# EAGLE design FCC Power Board Jan 2019 (EAGLE 9.2.2)
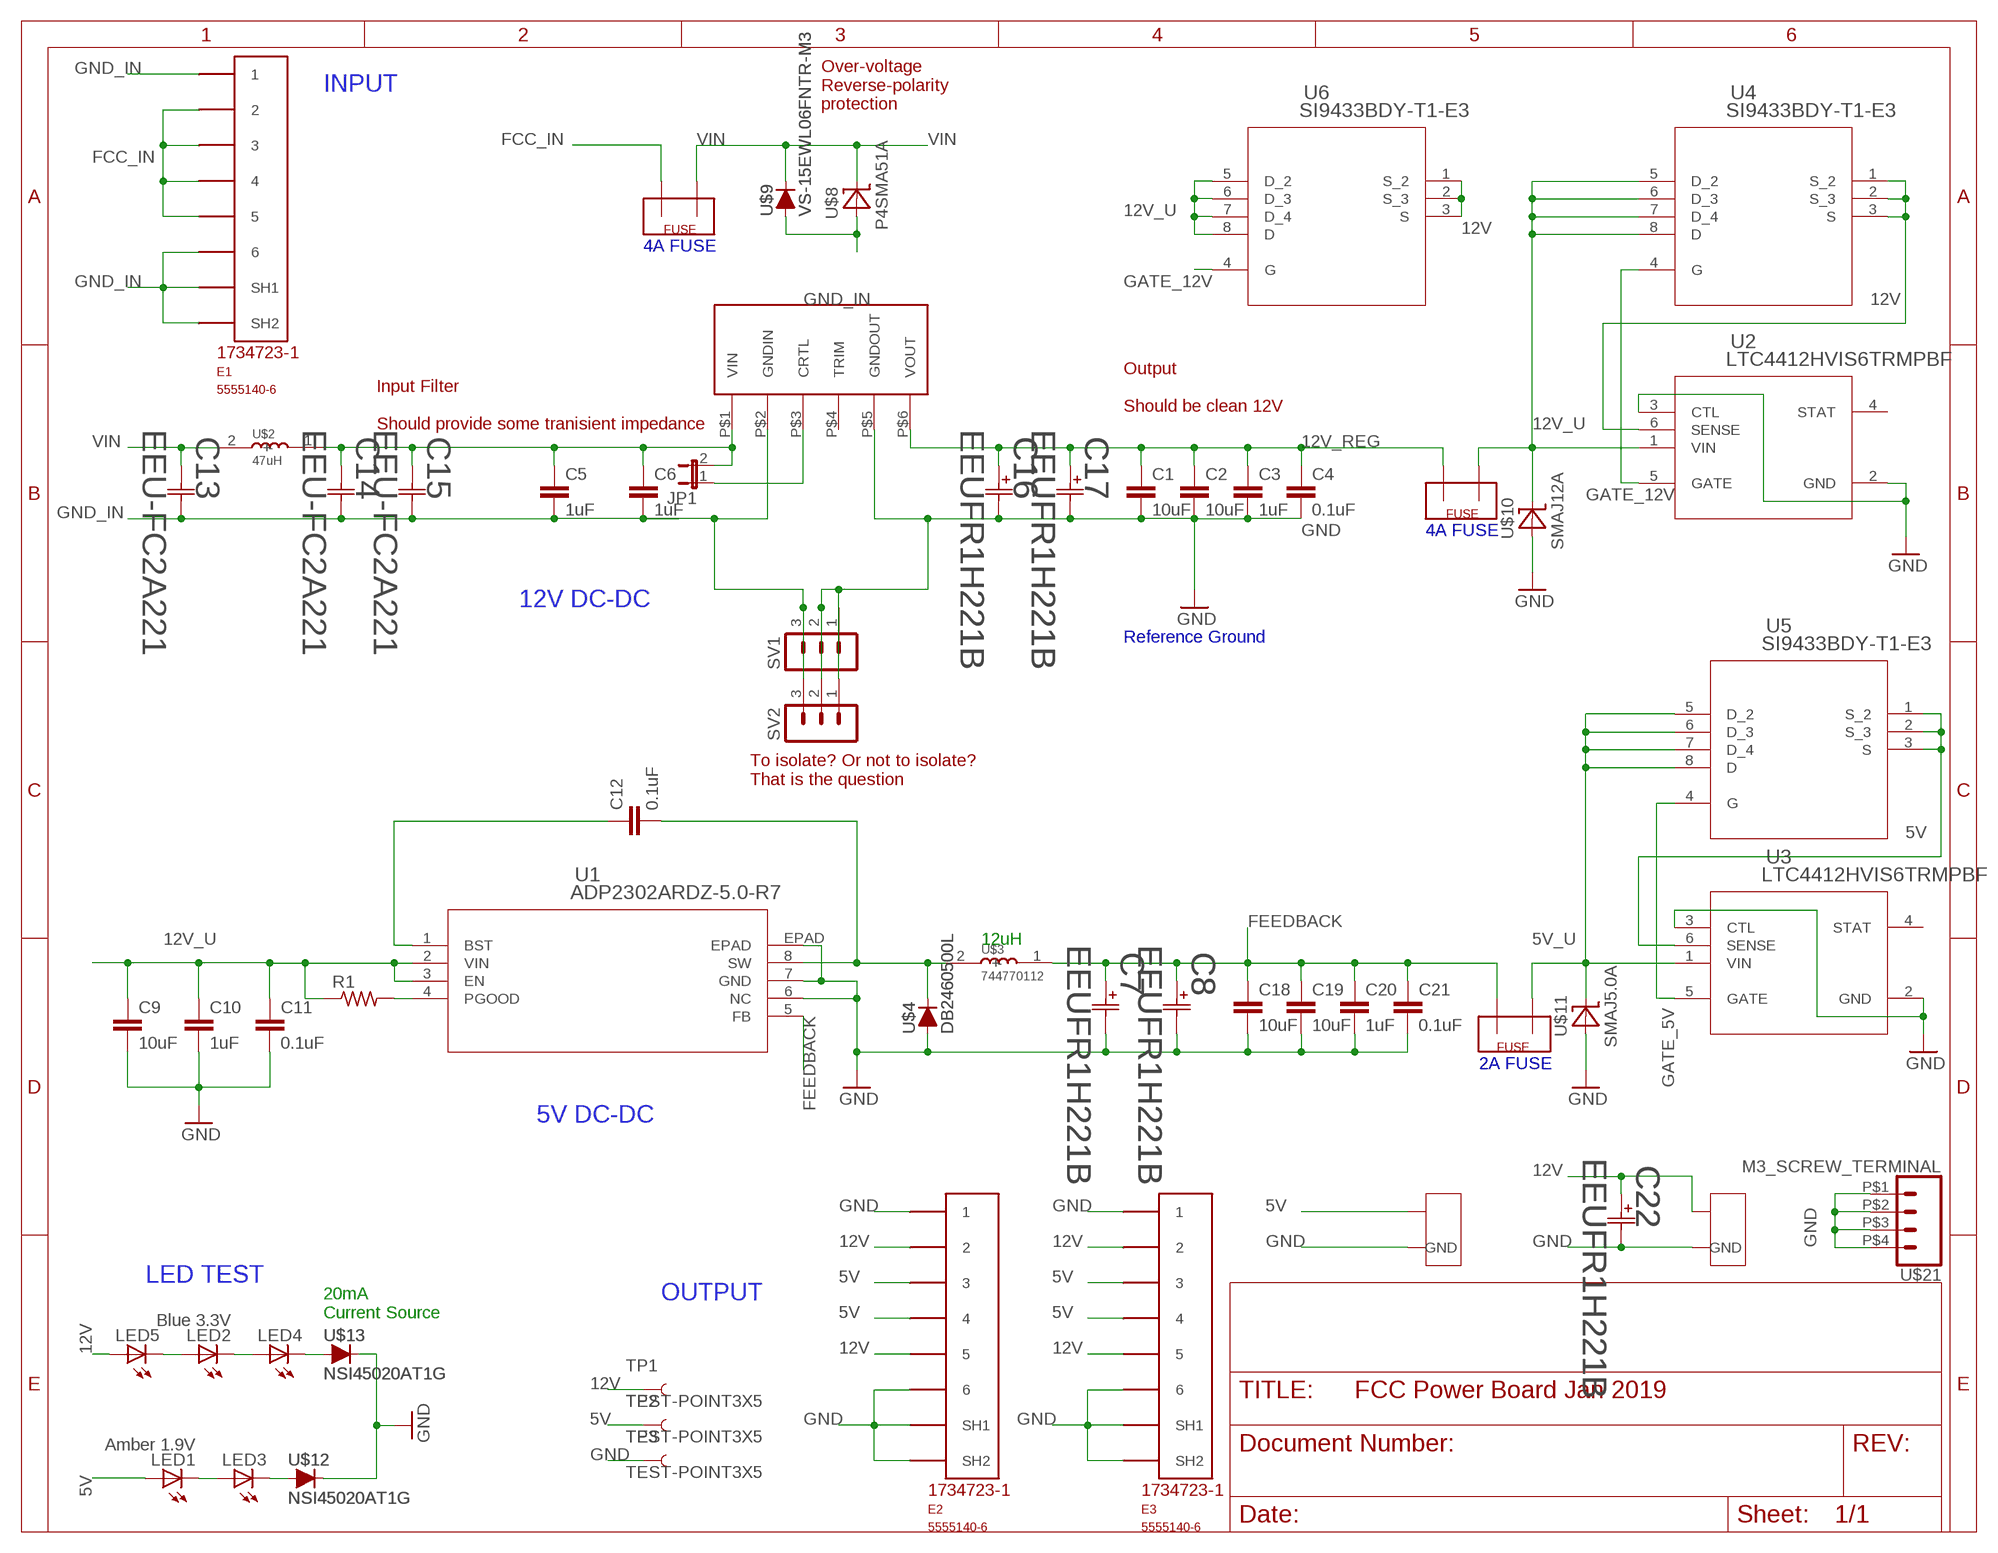
[diagram p0: schematic, sheet 1]

## Parts
C1  10uF  C-EUC1210  [C1210]
C2  10uF  C-EUC1210  [C1210]
C3  1uF  C-EUC0805  [C0805]
C4  0.1uF  C-EUC0603  [C0603]
C5  1uF  C-EUC1210  [C1210]
C6  1uF  C-EUC1210  [C1210]
C7  EEUFR1H221B  [CAP_PAN_10X16]
C8  EEUFR1H221B  [CAP_PAN_10X16]
C9  10uF  C-EUC1210  [C1210]
C10  1uF  C-EUC0805  [C0805]
C11  0.1uF  C-EUC0603  [C0603]
C12  0.1uF  C-EUC0603  [C0603]
C13  EEU-FC2A221  [CAP_16_X_25]
C14  EEU-FC2A221  [CAP_16_X_25]
C15  EEU-FC2A221  [CAP_16_X_25]
C16  EEUFR1H221B  [CAP_PAN_10X16]
C17  EEUFR1H221B  [CAP_PAN_10X16]
C18  10uF  C-EUC1210  [C1210]
C19  10uF  C-EUC1210  [C1210]
C20  1uF  C-EUC0805  [C0805]
C21  0.1uF  C-EUC0603  [C0603]
C22  EEUFR1H221B  [CAP_PAN_10X16]
E1  5555140-6  [1734723-1_RJ11]
E2  5555140-6  [1734723-1_RJ11]
E3  5555140-6  [1734723-1_RJ11]
JP1  JP1E  [JP1]
LED1  Amber 1.9V  LEDCHIPLED_0805  [CHIPLED_0805]
LED2  Blue 3.3V  LEDCHIPLED_0805  [CHIPLED_0805]
LED3  LEDCHIPLED_0805  [CHIPLED_0805]
LED4  LEDCHIPLED_0805  [CHIPLED_0805]
LED5  LEDCHIPLED_0805  [CHIPLED_0805]
R1  R-US_R0603  [R0603]
SV1  MA03-1  [MA03-1]
SV2  MA03-1  [MA03-1]
TP1  TEST-POINT3X5  [PAD.03X.05]
TP2  TEST-POINT3X5  [PAD.03X.05]
TP3  TEST-POINT3X5  [PAD.03X.05]
U1  ADP2302ARDZ-5.0-R7  [RD_8_1]
U2  LTC4412HVIS6TRMPBF  [TSOT-23_S6]
U3  LTC4412HVIS6TRMPBF  [TSOT-23_S6]
U4  SI9433BDY-T1-E3  [SOIC-N-8_SI]
U5  SI9433BDY-T1-E3  [SOIC-N-8_SI]
U6  SI9433BDY-T1-E3  [SOIC-N-8_SI]
U$1  RPA60-2412SFW_P  [RPA60-2412SFW/P]
U$2  47uH  PA4320  [INDUCTOR_SMD_FOOTPRINT]
U$3  744770112  [INDUCTOR_SMD_FOOTPRINT]
U$4  DB2460500L  [SOD123]
U$5  SHELL2013_FUSEMINI-BLADE  [SHELL2013_MINI-BLADE-FUSE]
U$6  SHELL2013_FUSEMINI-BLADE  [SHELL2013_MINI-BLADE-FUSE]
U$7  SHELL2013_FUSEMINI-BLADE  [SHELL2013_MINI-BLADE-FUSE]
U$8  P4SMA51A  [SMA-DO214AC]
U$9  VS-15EWL06FNTR-M3  [TO252]
U$10  SMAJ12A  [SMA-DO214AC]
U$11  SMAJ5.0A  [SMA-DO214AC]
U$12  NSI45020AT1G  [SOD123]
U$13  NSI45020AT1G  [SOD123]
U$18  2X1-CONN  [2X1-MATE-N-LOCK]
U$20  2X1-CONN  [2X1-MATE-N-LOCK]
U$21  M3_SCREW_TERMINAL  [M3_SCREW_TERMINAL]

## Nets
5V: E2.3 E2.4 E3.3 E3.4 LED1.A TP2.P$1 U3.6(SENSE) U5.1(S_2) U5.2(S_3) U5.3(S) U$18.CIRCUIT1
5V_U: U3.1(VIN) U5.5(D_2) U5.6(D_3) U5.7(D_4) U5.8(D) U$5.OUT U$11.K(C)
12V: C22.1 E2.2 E2.5 E3.2 E3.5 LED5.A TP1.P$1 U2.6(SENSE) U4.1(S_2) U4.2(S_3) U4.3(S) U6.1(S_2) U6.2(S_3) U6.3(S) U$20.CIRCUIT1
12V_REG: C1.1 C2.1 C3.1 C4.1 C16.1 C17.1 U$1.P$6(VOUT) U$7.OUT
12V_U: C9.1 C10.1 C11.1 R1.1 U1.2(VIN) U1.3(EN) U2.1(VIN) U4.5(D_2) U4.6(D_3) U4.7(D_4) U4.8(D) U6.5(D_2) U6.6(D_3) U6.7(D_4) U6.8(D) U$7.IN U$10.K(C)
FCC_IN: E1.2 E1.3 E1.4 E1.5 U$6.OUT
FEEDBACK: C7.1 C8.1 C18.1 C19.1 C20.1 C21.1 U1.5(FB) U$3.1(+) U$5.IN
GATE_5V: U3.5(GATE) U5.4(G)
GATE_12V: U2.5(GATE) U4.4(G) U6.4(G)
GND: C1.2 C2.2 C3.2 C4.2 C7.2 C8.2 C9.2 C10.2 C11.2 C16.2 C17.2 C18.2 C19.2 C20.2 C21.2 C22.2 E2.1 E2.6 E2.SH1 E2.SH2 E3.1 E3.6 E3.SH1 E3.SH2 SV1.1 SV1.2 SV2.1 SV2.2 TP3.P$1 U1.6(NC) U1.7(GND) U1.EPAD U2.2(GND) U2.3(CTL) U3.2(GND) U3.3(CTL) U$1.P$5(GNDOUT) U$4.A U$10.A U$11.A U$12.C U$13.C U$18.GND U$20.GND U$21.P$1 U$21.P$2 U$21.P$3 U$21.P$4
GND_IN: C5.2 C6.2 C13.2 C14.2 C15.2 E1.1 E1.6 E1.SH1 E1.SH2 SV1.3 SV2.3 U$1.P$2(GNDIN) U$8.A U$9.1(A) U$9.2(A)
N$1: JP1.1 U$1.P$3(CRTL)
N$3: C12.1 U1.1(BST)
N$4: C12.2 U1.8(SW) U$3.2(-) U$4.C
N$5: R1.2 U1.4(PGOOD)
N$7: LED1.C LED3.A
N$8: LED3.C U$12.A
N$9: LED4.C U$13.A
N$10: LED2.C LED4.A
N$11: LED2.A LED5.C
N$12: C5.1 C6.1 C14.1 C15.1 JP1.2 U$1.P$1(VIN) U$2.1(+)
VIN: C13.1 U$2.2(-) U$6.IN U$8.K(C) U$9.3(C)
Unconnected: U2.4(STAT) U3.4(STAT) U$1.P$4(TRIM)

## Notes on the sheet
- INPUT
- Over-voltage
  Reverse-polarity 
  protection
- 4A FUSE
- Output
  
  Should be clean 12V
- Input Filter
  
  Should provide some tranisient impedance
- 4A FUSE
- 12V DC-DC
- Reference Ground
- To isolate? Or not to isolate?
  That is the question
- 12uH
- 2A FUSE
- 5V DC-DC
- LED TEST
- OUTPUT
- 20mA 
  Current Source

## Library data of the parts
C1-C6 C9-C12 C18-C21 = rcl:C-EU: CAPACITOR, European symbol; SPICEPREFIX: C
C7 C8 C16 C17 C22 = MotorControllerEagleLibrary:EEUFR1H221B: Panasonic Capacitor, Digikey number P15375CT-ND; MANUFACTURER_PART_NUMBER: EEUFR1H221B; VENDOR: PANASONIC
C13-C15 = fc power board:EEU-FC2A221; MANUFACTURER_PART_NUMBER: EEUFC2A221; VENDOR: Panasonic
E1-E3 = 5555140-6 RJ11:5555140-6
JP1 = jumper:JP1E: JUMPER
LED1-LED5 = led:LED: LED OSRAM: - CHIPLED LG R971, LG N971, LY N971, LG Q971, LY Q971, LO R971, LY R971 LH N974, LH R974 LS Q976, LO Q976, LY Q976 LO Q996 - Hyper CHIPLED LW Q18S LB Q993, LB Q99A, LB R99A - SideLED LS A670, LO A670, LY A670, LG A670, LP A670 LB A673, LV A673, LT A673, LW A673 LH A674 LY A675 LS A676, LA A676, LO A676, LY A676, LW A676 LS A679, LY A679, LG A679 - Hyper Micro SIDELED® LS Y876, LA Y876, LO Y876, LY Y876 LT Y87S - SmartLED LW L88C, LW L88S LB L89C, LB L89S, LG L890 LS L89K, LO L89K, LY L89K LS L896, LA L896, LO L896, LY L896 - TOPLED LS T670, LO T670, LY T670, LG T670, LP T670 LSG T670, LSP T670, LSY T670, LOP T670, LYG T670 LG T671, LOG T671, LSG T671 LB T673, LV T673, LT T673, LW T673 LH T674 LS T676, LA T676, LO T676, LY T676, LB T676, LH T676, LSB T676, LW T676 LB T67C, LV T67C, LT T67C, LS T67K, LO T67K, LY T67K, LW E67C LS E67B, LA E67B, LO E67B, LY E67B, LB E67C, LV E67C, LT E67C LW T67C LS T679, LY T679, LG T679 LS T770, LO T770, LY T770, LG T770, LP T770 LB T773, LV T773, LT T773, LW T773 LH T774 LS E675, LA E675, LY E675, LS T675 LS T776, LA T776, LO T776, LY T776, LB T776 LHGB T686 LT T68C, LB T68C - Hyper Mini TOPLED® LB M676 - Mini TOPLED Santana® LG M470 LS M47K, LO M47K, LY M47K Source: http://www.osram.convergy.de LUXEON: - LUMILED® LXK2-PW12-R00, LXK2-PW12-S00, LXK2-PW14-U00, LXK2-PW14-V00 LXK2-PM12-R00, LXK2-PM12-S00, LXK2-PM14-U00 LXK2-PE12-Q00, LXK2-PE12-R00, LXK2-PE12-S00, LXK2-PE14-T00, LXK2-PE14-U00 LXK2-PB12-K00, LXK2-PB12-L00, LXK2-PB12-M00, LXK2-PB14-N00, LXK2-PB14-P00, LXK2-PB14-Q00 LXK2-PR12-L00, LXK2-PR12-M00, LXK2-PR14-Q00, LXK2-PR14-R00 LXK2-PD12-Q00, LXK2-PD12-R00, LXK2-PD12-S00 LXK2-PH12-R00, LXK2-PH12-S00 LXK2-PL12-P00, LXK2-PL12-Q00, LXK2-PL12-R00 Source: www.luxeon.com KINGBRIGHT: KA-3528ASYC Source: www.kingbright.com
R1 = resistor:R-US_: RESISTOR, American symbol
SV1 SV2 = con-lstb:MA03-1: PIN HEADER; OC_FARNELL: unknown; OC_NEWARK: unknown
TP1-TP3 = SparkFun-Connectors:TEST-POINT: SparkFun Test Points Bare copper test points for troubleshooting or In-Circuit-Testing. These are used by our Production team for verifying production board runs using pogo-pins on test beds. SparkFun Products: SparkFun LSM9DS1 Breakout <https://www.sparkfun.com/products/13284> SparkFun PSOC <https://www.sparkfun.com/products/13714> SparkFun Load Cell Amplifier <https://www.sparkfun.com/products/13879>
U1 = fc power board:ADP2302ARDZ-5.0-R7; MANUFACTURER_PART_NUMBER: ADP2302ARDZ5.0R7; VENDOR: Analog Devices Inc
U2 U3 = fc power board:LTC4412HVIS6TRMPBF; MANUFACTURER_PART_NUMBER: LTC4412HVIS6#TRMPBF; VENDOR: Linear Technology
U4-U6 = fc power board:SI9433BDY-T1-E3; MANUFACTURER_PART_NUMBER: SI9433BDYT1E3; VENDOR: Vishay
U$1 = RPA60-2412SFW_P:RPA60-2412SFW_P
U$2 = MotorControllerEagleLibrary:PA4320: Pulse Inductor, Digikey number 553-3685-1-ND.
U$3 = MotorControllerEagleLibrary:744770112
U$4 = fc power board:DB2460500L
U$5-U$7 = fc power board:SHELL2013_FUSE
U$8 = fc power board:P4SMA51A
U$9 = fc power board:VS-15EWL06FNTR-M3
U$10 = fc power board:SMAJ12A
U$11 = fc power board:SMAJ5.0A
U$12 U$13 = fc power board:NSI45020AT1G
U$18 U$20 = hydrogen_sensors_board_v3:2X1-CONN
U$21 = 36-7771-ND:M3_SCREW_TERMINAL

## Board
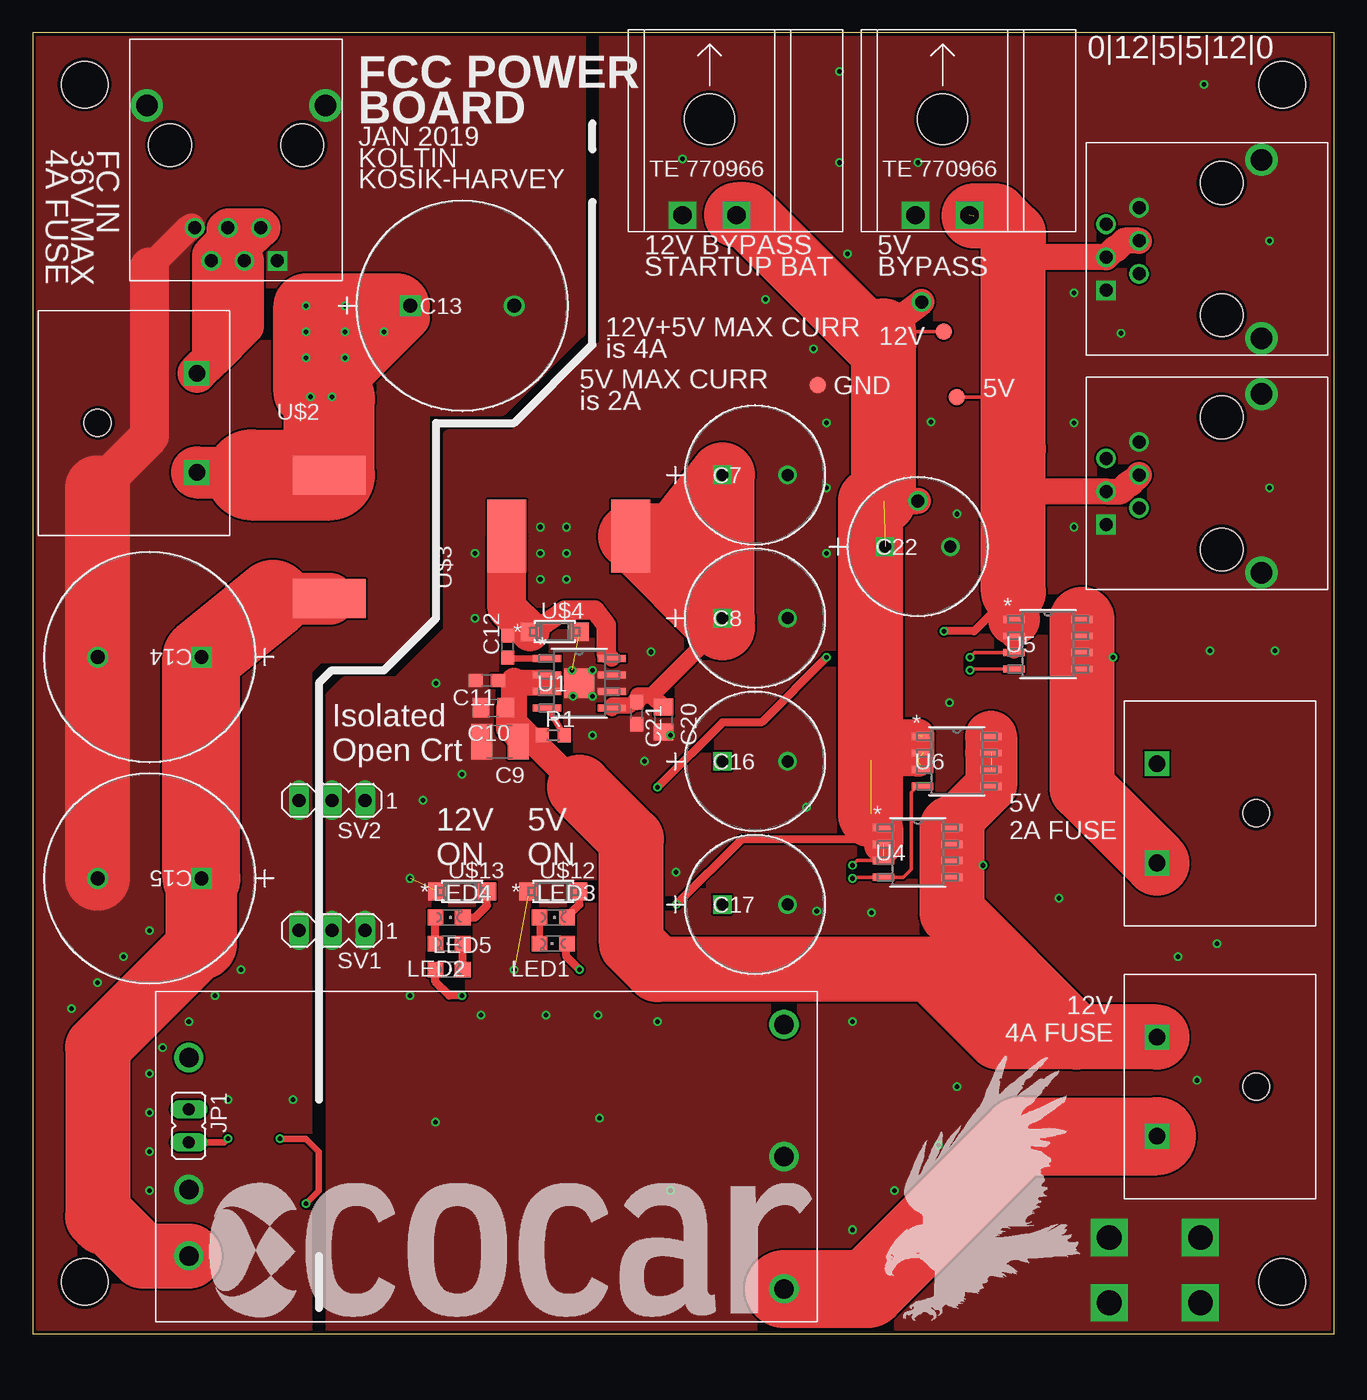
[diagram p1: board, top side]
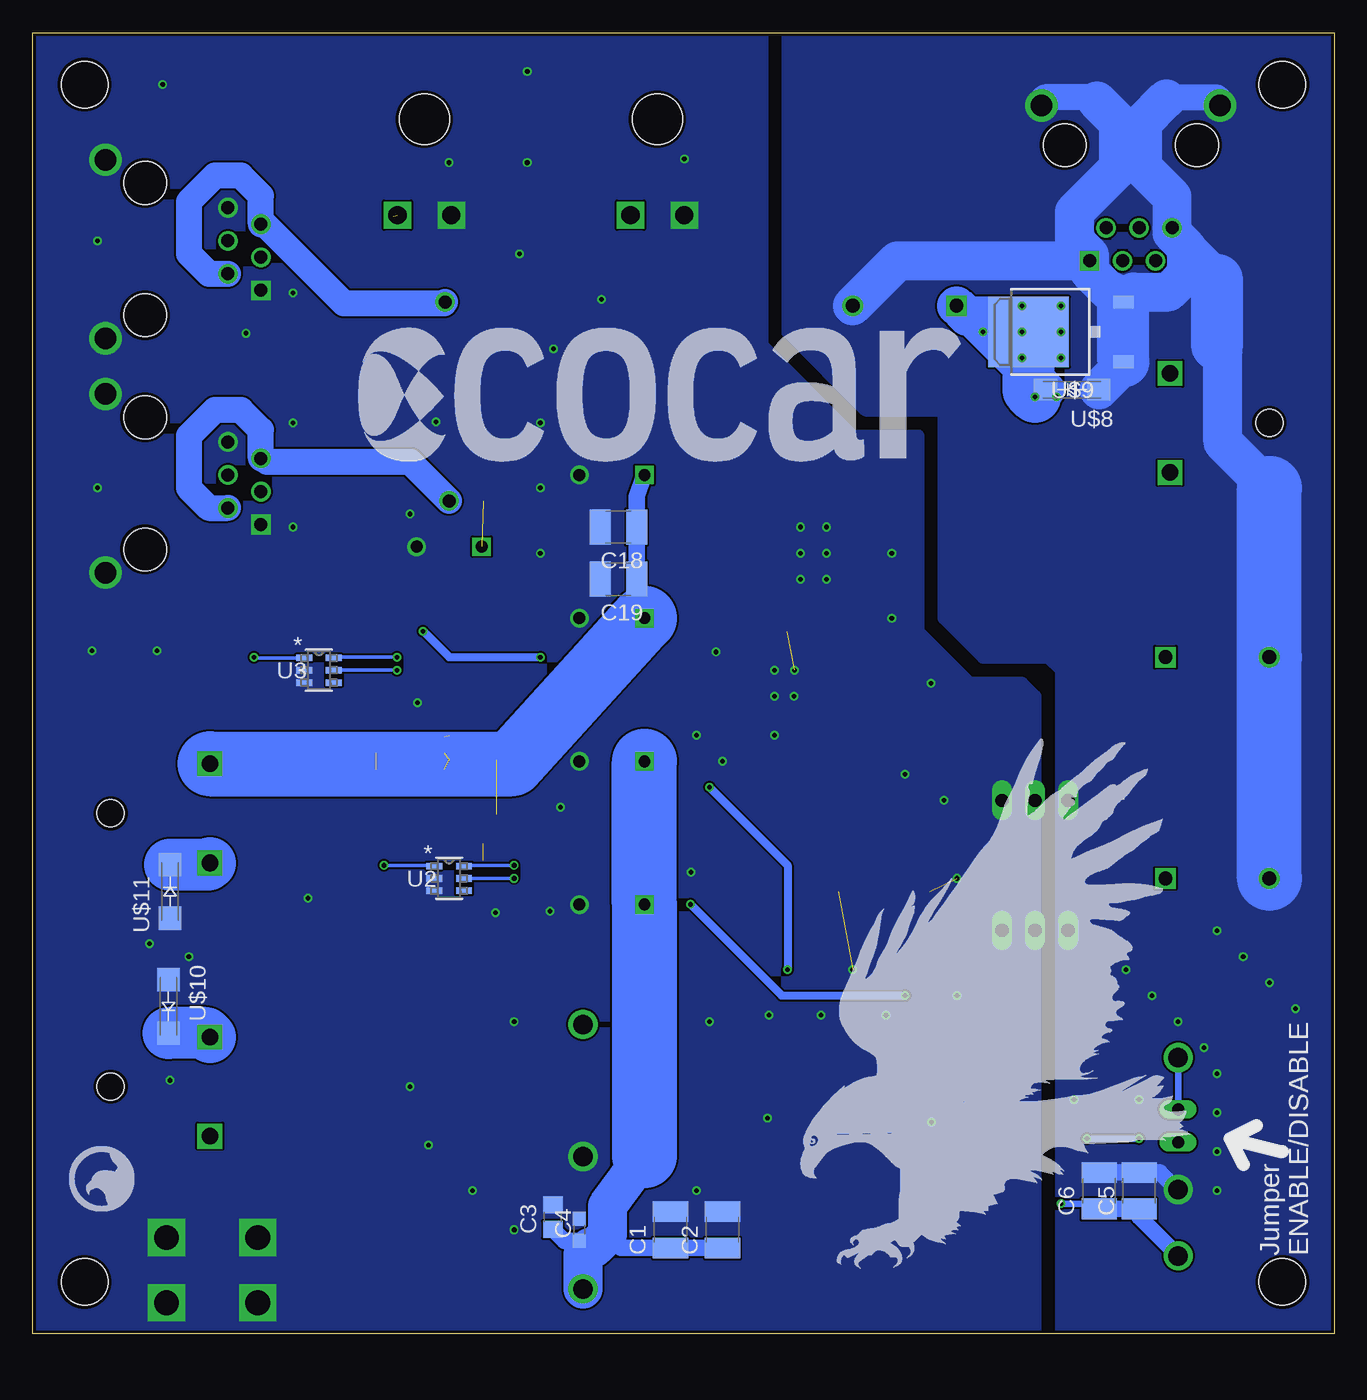
[diagram p2: board, bottom side, seen from below]

Size 100 x 100 mm. Coordinates in mm from the lower left corner, seen from the top.
Outline: 0,0 100,0 100,100 0,100 0,0
Copper layers (1*16): Top 0.035mm / dielectric 1.5mm / Bottom 0.035mm
Design rules "SeeedStudio_2layer_DRU_no_angle_20140221": minimum track width 6mil, minimum drill 12mil, track to track 6mil, track to pad 6mil, pad to pad 6mil, via to via 6mil, smd to smd 0mil, copper to edge 10mil, drill to drill 10mil, minimum pad ring 10mil, minimum via ring 6mil, stop-mask expansion 2mil, vias tented up to drill 100mil, thermal gap 10mil
Holes 3.6 mm at 96,96 96,4 4,96 4,4

### Footprints (pad centres in the part's own frame; a part is rotated, then mirrored left to right if it is on the bottom)
C1210 = smd 1.6 x 2.7: 1 -1.4,0; 2 1.4,0
C0805 = smd 1.3 x 1.5: 1 -0.95,0; 2 0.95,0
C0603 = smd 1.1 x 1: 1 -0.85,0; 2 0.85,0
CAP_PAN_10X16 = drill 0.914 pad 1.422 square: 1 -5.004,0 | drill 0.914 pad 1.422: 2 0,0
CAP_16_X_25 = drill 1.067 pad 1.575 square: 1 -7.976,0 | drill 1.067 pad 1.575: 2 0,0
1734723-1_RJ11 = drill 1 square: 1 -3.81,2.54 | drill 1: 2 -2.54,0; 3 -1.27,2.54; 4 0,0; 5 1.27,2.54; 6 2.54,0 | drill 1.65: SH1 -7.5,-9.4; SH2 6.22,-9.4 | hole 3.3: -5.72,-6.35; 4.44,-6.35
JP1 = drill 0.914 long: 1 0,-1.27; 2 0,1.27
CHIPLED_0805 = smd 1.2 x 1.2: A 0,-1.05; C 0,1.05
R0603 = smd 1 x 1.1: 1 -0.85,0; 2 0.85,0
MA03-1 = drill 1.016 long: 1 -2.54,0; 2 0,0; 3 2.54,0
PAD.03X.05 = smd 1.27 x 1.27: P$1 0,0
RD_8_1 = smd 2.184 x 0.559: 1 -2.489,1.905; 2 -2.489,0.635; 3 -2.489,-0.635; 4 -2.489,-1.905; 5 2.489,-1.905; 6 2.489,-0.635; 7 2.489,0.635; 8 2.489,1.905 | smd 2.286 x 2.286: EPAD 0,0
TSOT-23_S6 = smd 1.219 x 0.508: 1 -1.143,0.95; 2 -1.143,0; 3 -1.143,-0.95; 4 1.143,-0.95; 5 1.143,0; 6 1.143,0.95
SOIC-N-8_SI = smd 1.651 x 0.559: 1 -2.629,1.905; 2 -2.629,0.635; 3 -2.629,-0.635; 4 -2.629,-1.905; 5 2.629,-1.905; 6 2.629,-0.635; 7 2.629,0.635; 8 2.629,1.905
RPA60-2412SFW/P = drill 1.5: P$1 0,0; P$2 0,5.08; P$3 0,15.24; P$4 45.72,17.78; P$5 45.72,7.62; P$6 45.72,-2.54
INDUCTOR_SMD_FOOTPRINT = smd 5.6 x 3: 1 2.8,1.5; 2 2.8,11
SOD123 = smd 1.111 x 0.601: 1 -1.725,0; 2 1.725,0 | smd 1.4 x 1.4: A 1.9,0; C -1.9,0
SHELL2013_MINI-BLADE-FUSE = drill 1.27 square: IN 3.81,7.62; OUT -3.81,7.62 | hole 2.083: 0,0
SMA-DO214AC = smd 1.8 x 1.7: A -2.05,0; K 2.05,0
TO252 = smd 1 x 1.6: 1 -2.28,-4.8; 2 2.28,-4.8 | smd 5.4 x 6.2: 3 0,2.5
2X1-MATE-N-LOCK = drill 1.4 square: CIRCUIT1 -2.07,14.23; GND 2.07,14.23 | hole 3.86: 0,6.86
M3_SCREW_TERMINAL = drill 1.9 square: P$1 0,0; P$2 0,7.01; P$3 5,7.01; P$4 5,0

### Placement (x,y rotation side)
C1  51,8 90 bottom
C2  47,8 90 bottom
C3  60.04,8.98 90 bottom
C4  58,8 90 bottom
C5  15,11 90 bottom
C6  18.07,11 90 bottom
C7  58,66 0 top
C8  58,55 0 top
C9  35.9,45.5 180 top
C10  35.4,48.1 180 top
C11  34.9,50.2 180 top
C12  36.49,52.82 90 top
C13  37,79 0 top
C14  5,52 180 top
C15  5,35 180 top
C16  58,44 0 top
C17  58,33 0 top
C18  55,62 180 bottom
C19  55,58 180 bottom
C20  48.47,47.21 270 top
C21  46.4,47.7 270 top
C22  70.5,60.5 0 top
E1  15,85 180 top
E2  85,66 90 top
E3  85,84 90 top
JP1  12,16 180 top
LED1  40,30 90 top
LED2  32,30 90 top
LED3  40,32 270 top
LED4  32,32 270 top
LED5  32,28 270 top
R1  40,46 0 top
SV1  23,31 180 top
SV2  23,41 180 top
TP1  70,77 0 top
TP2  71,72 0 top
TP3  60.3,72.9 0 top
U1  42,50 0 top
U2  68,35 0 bottom
U3  78,51 0 bottom
U4  68,37 0 top
U5  78,53 0 top
U6  71,44 0 top
U$1  12,6 0 top
U$2  20,55 0 top
U$3  47.44,58.5 90 top
U$4  40.12,53.96 0 top
U$5  94,40 90 top
U$6  5,70 270 top
U$7  94,19 90 top
U$8  20.15,72.56 180 bottom
U$9  21,77 90 bottom
U$10  89.56,25.17 270 bottom
U$11  89.44,33.99 90 bottom
U$12  40,34 0 top
U$13  33,34 0 top
U$14  [ECOCAR_LOGO_2018]  13.57,1.28 0 top
U$15  [ECOCAR_LOGO_2018]  75,67 0 bottom
U$16  [CS-2016-LOGO-5MM]  98.1,8.5 0 bottom
U$17  [EAGLE-PLC-30MM]  41,5 0 bottom
U$18  69.9,100.2 180 top
U$19  [EAGLE-PLC-15MM]  65.5,1 0 top
U$20  52,100.2 180 top
U$21  82.7,7.4 270 top

### Tracks (layer width: path | path; a pad name or v marks a point on that pad's centre or on a via)
5V  (via drill 0.35)  (1 unrouted)
  Top 0.254: v72,52 72.36,52.37 U5.3 | TP2.P$1 75,72 75.34,69.66 75.34,68
  Top 0.61: 75.34,57.01 72.33,54 v70,54 | v61,52 56,47 53,47 v48,42 | v42,28 41,29 41,29.95 LED1.A | 74.48,84.52 75.34,84.52
  Top 1: U5.3 U5.2
  Top 2: U5.2 U5.1 | 75.34,84.12 76.09,84.87 | 75.34,68 76.07,67.27 | 75.34,65 75.61,64.73 E2.3 83.57,64.73 84.21,65.37 84.37,65.37 E2.4 | 75.34,84.52 77.13,82.73 E3.3 83.09,83.36 83.25,83.36 83.89,84 E3.4
  Top 4: U5.1 75.37,56.98 75.34,57.01
  Top 5: 75.34,57.01 75.34,65 75.34,68 75.34,84.12 75.34,84.52 | 75.34,84.52 75.36,84.54 | 75.34,84.52 73.96,85.9 72.3,85.9
  Bottom 0.254: U3.6 76.81,52 v72,52
  Bottom 0.61: v70,54 68,52 v61,52 | v48,42 42,36 v42,28
5V_U  (via drill 0.35)
  Top 0.254: 82.26,52 v83,52 81.53,52 U5.5
  Top 5: U$5.OUT 80.63,41.94 U5.5 U5.6 U5.7 U5.8
  Bottom 0.254: U3.1 82.95,51.95 v83,52
  Bottom 4: U$5.OUT 86.53,36.04 U$11.K
12V  (via drill 0.35, 1)  (6 unrouted)
  Top 0.254: v63,36 63.37,36.37 U4.3 | TP1.P$1 65.38,77
  Top 0.61: U4.1 64.47,38 62,38 54.46,37.99 v49.46,33 | v33,26 32,26 30.95,27.05 LED5.A
  Top 2: 64.37,64 65.38,64 v68,64 | v68.3,79.3 68.3,79.29 65.38,77.06
  Top 2.54: 64.6,46 68,46 68,44.1 64.4,44.1
  Top 3: 64.37,39.91 U4.1 U4.2
  Top 5: 64.37,39.91 64.37,64 | 65.38,64 65.38,76.04 | 65.38,77.06 65.38,77 65.38,76.04 | 65.38,76.04 65.08,75.74 54.82,86 54.1,86 U$20.CIRCUIT1 | 65.38,76.04 65.4,76.06
  Bottom 0.254: U2.6 66.81,36 v63,36
  Bottom 0.61: v49.46,33 42.45,26 v33,26
  Bottom 2: v68,64 71,67 82,67 82.27,67.27 E2.5 82.46,69.46 84,71 86,71 88,69 88,65 86.46,63.46 E2.2 | v68.3,79.3 68.4,79.2 76.09,79.2 82.16,85.27 E3.5 82.46,87.46 84,89 86,89 88,87 88,83 86.46,81.46 E3.2
12V_REG
  Top 6: U$1.P$6 64.15,3.46 75.88,15.19 U$7.OUT
  Bottom 1.27: C2.1 C1.1 54.83,6.6 55.85,7.62 | U$1.P$6 57,5.18 C4.1 59.16,7.15 C3.1
  Bottom 3: 53,13.69 55.85,9.84 55.85,7.62 56.82,6.65 57.2,6.65 57.72,6.13 U$1.P$6
  Bottom 5: C16.1 C17.1 53,13.69
12V_U  (via drill 0.35)  (1 unrouted)
  Top 0.254: v73,36 72.64,36.37 U4.6
  Top 0.508: C11.1 37,50.2 39.2,50.2 U1.2 | U1.3 39.63,50.05 | C9.1 37.8,46 R1.1
  Top 0.61: C9.1 38.09,46.29
  Top 1.5: 38.82,50.05 39.63,50.05 | C10.1 36.35,46.45 C9.1 37,45.8 37,47
  Top 2: 42.01,41.99 37,47 37,50.2 37.15,50.05 39.63,50.05
  Top 2.54: 70.63,39.09 U4.7
  Top 4: 70.63,39.09 U6.5 U6.7 U6.8
  Top 5: 80.19,22.81 70.63,32.37 U4.5 U4.6 U4.7 U4.8 | U$7.IN 80.19,22.81 | 80.19,22.81 74.19,22.81 69,28 48,28 46,30 46,38 42.01,41.99
  Bottom 0.254: U2.1 69.19,36 v73,36
  Bottom 4: U$7.IN 86.69,23.12 U$10.K
FCC_IN
  Top 1.5: E1.3 16.27,83.77
  Top 3: 16.27,83.77 17.37,84.87 17.41,84.87 E1.2 E1.4 14.87,84.87 14.87,84 13.73,82.87 E1.5 | E1.5 13.73,74.92 | 13.73,74.92 U$6.OUT | E1.5 14,82.19 14,82 15.81,82 E1.3 16.27,77.46 13.73,74.92
FEEDBACK
  Top 0.61: 52.52,54 C8.1
  Top 1: 46.53,49.05 45.78,48.3
  Top 1.27: 45.78,48.3 44.56,48.3 U1.5 | 47.58,49.05 46.53,49.05 46.53,48.69 C21.1 | 47.58,49.05 C20.1 | 47.58,49.05 52.52,54
  Top 5: 53,54.24 C8.1 C7.1 49.3,61.3 U$3.1 53,54.24
  Bottom 1.27: C7.1 53.6,64.4 C18.1 C19.1 53.6,54.6 C8.1
  Bottom 5: U$5.IN 63.19,43.81 C8.1
GATE_5V  (via drill 0.35)
  Top 0.254: v72,51 72.09,51.09 U5.4
  Bottom 0.254: U3.5 v72,51
GATE_12V  (via drill 0.35)
  Top 0.254: v63,35 63.09,35.09 U4.4 66.89,35.09 67.5,35.7 67.5,41.6 68,42.09 U6.4
  Bottom 0.254: U2.5 v63,35
GND  (via drill 0.35)  (3 unrouted)
  other vias: 49,46 41.52,49.01 61,60 95,65 95,84 61,70 88,29 62,97 49.44,35.48 69.6,14.5 63,24 49,11 63,8 71,19 91,30 31,50 34,55 34,60 43,46 48,24 66.2,11 41.45,51.01 41,60 39,60 41,62 39,62 39,58 41,58 43,49 43,51 34.44,24.48 39.44,24.48 43.44,24.48 59.44,40.48 60.24,32.48 70.44,48.48 90.44,52.48 95.44,52.48 89.44,19.48 33,43 30,41 29,35 29,26 37,28 47,44 62.6,83 56.3,79.5 61,65 71,63 83.6,76.9 69,70.1 60,75.7 80,70 80,62 80,80 90,96 68,90 62,90 43.54,16.58 30.94,16.28 64.44,32.38 78.84,33.48 49.94,90.28 47.5,52.4
  pour Top (no thermals): 44,104 44,76 37,69 32,69 32,54 28,50 24,50 23,49 23,-2 104,-2 104,104
  pour Bottom (no thermals): 44,102 44,76 37,69 32,69 32,54 28,50 24,50 23,49 23,-2 102,-2 102,102
GND_IN  (via drill 0.35)
  Top 2: 9,82 12,85 12.11,85 12.21,85.1
  Top 3: C14.2 5,65 6.44,66.44 6.47,66.44 8.56,68.53 8.56,68.56 9,69 9,82
  Top 5: C15.2 5,65
  Bottom 1.27: U$1.P$2 12.08,11.08 13.4,12.4 C5.2 C6.2
  Bottom 2: 22.68,94.58 22.24,95.02 18.49,95.02 18.24,94.76 | 8.6,94.58 9.04,95.02 12.79,95.02 12.9,94.9 | 11,83 12.46,84.46 12.46,84.59
  Bottom 3: U$8.A 16.2,74.46 U$9.1 | E1.1 18.81,81.6 17.27,80.05 16.97,80.05 U$9.2 15.43,80.05 12.73,80.05 11.32,81.46 11.32,83.46 12.46,84.59 E1.6 12.46,87.36 14.73,89.62 14.73,93.08 12.9,94.9 | E1.1 18.81,82.87 19.95,84 19.95,86.23 16.55,89.62 16.55,93.08 18.24,94.76 | C13.2 33.54,82.46 E1.1 | 9,76 8.56,75.56 8.56,68.53 5,64.97 | 9,81 11,83
  Bottom 4: U$9.1 U$9.2 | 9,76 9,81
  Bottom 5: 5,64.97 C14.2 C15.2
  other vias: 20,18 15,18 9,20 9,17 9,14 9,11 3,25 5,27 7,29 9,31 10,22 12,24 14,26 16,28
  pour Bottom (no thermals): -4,104 42,104 42,77 36,71 30,71 30,55 27,52 22,52 21,51 21,-2 -4,-2
  pour Top (no thermals): -2,102 42,102 42,77 36,71 30,71 30,55 29,54 27,52 22,52 21,51 21,50 21,-2 -1,-2 -2,-2
N$1
  Bottom 0.508: U$1.P$3 JP1.1
N$3
  Top 0.508: U1.1 36.55,51.91 C12.1
N$4
  Top 0.508: C12.2 37.93,53.67 U$4.C
  Top 1.27: U1.8 44.07,52.29 | 38.51,53.96 U$4.C
  Top 1.5: 44.07,52.29 44.06,54.48 43.2,55.62 40.88,55.62 38.51,53.96
  Top 3: U$4.C 36.44,55.74 U$3.2
N$5
  Top 0.508: R1.2 39.58,48.13 U1.4
N$7
  Top 0.508: LED1.C LED3.A
N$8
  Top 0.61: LED3.C 41.05,32.05 42,33 42,33.9 U$12.A
N$9
  Top 0.61: LED4.C 34,32 34.9,32.9 U$13.A
N$10
  Top 0.61: LED2.C LED4.A
N$11
  Top 0.61: LED5.C LED2.A
N$12  (via drill 0.35)
  Top 0.508: JP1.2 14.73,14.73 v15,15 | v19,15 21,15 22,14 22,11 v21,10
  Top 4: 18.48,56.5 U$2.1
  Top 5: 12.98,29.98 5,22 5,9 5.45,8.55 5.89,8.55 8.44,6 U$1.P$1
  Top 5.5: C15.1 12.98,29.98
  Top 6: C15.1 C14.1 18.48,56.5
  Bottom 0.508: v15,15 v19,15 | v21,10 18.48,10 C6.1
  Bottom 1.27: U$1.P$1 15,9 C5.1 C6.1
VIN  (via drill 0.35)
  Top 0.5: 23,78 22,77 v21,77 v21,75 | v21,79 22,78 25,78 v24,79 v24,77 v24,75 | v27,77 28.02,78.02 29.02,78.02
  Top 3: v23,72 29.02,78.02 C13.1
  Top 4: U$6.IN 16.63,66.19 16.82,66 | 22.8,71.8 v23,72
  Top 5: 23,78 v23,72 | 28,79 v24,79 v21,79 v21,77 21,72.36 v21.36,72
  Top 7: 16.82,66 U$2.2 22.8,71.8
  Bottom 3: U$9.3 24.7,78.2 27.84,78.2 | C13.1 28.22,78.2 27.84,78.2 | U$8.K 27.84,78.2
  Bottom 4: U$9.3 23.5,72.5 v23,72

### Text on the board
tPlace: 0|12|5|5|12|0 | FCC POWER / BOARD | FC IN / 36V MAX / 4A FUSE | JAN 2019 / KOLTIN / KOSIK-HARVEY | 12V BYPASS / STARTUP BAT | 5V / BYPASS | 12V | 12V+5V MAX CURR / is 4A | GND | 5V | 5V MAX CURR / is 2A | Isolated / Open Crt | 5V / 2A FUSE | 12V / ON | 5V / ON | 12V / 4A FUSE
bPlace: Jumper / ENABLE/DISABLE